# EAGLE design board (EAGLE 9.6.2)
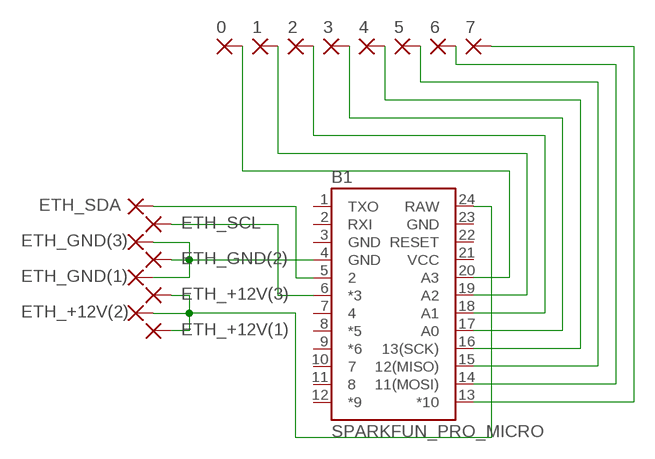
[diagram p0: schematic, sheet 1]

## Parts
0  2,15/1,0  [2,15/1,0]
1  2,15/1,0  [2,15/1,0]
2  2,15/1,0  [2,15/1,0]
3  2,15/1,0  [2,15/1,0]
4  2,15/1,0  [2,15/1,0]
5  2,15/1,0  [2,15/1,0]
6  2,15/1,0  [2,15/1,0]
7  2,15/1,0  [2,15/1,0]
B1  SPARKFUN_PRO_MICRO  [SPARKFUN_PRO_MICRO]
ETH_+12V(1)  2,15/1,0  [2,15/1,0]
ETH_+12V(2)  2,15/1,0  [2,15/1,0]
ETH_+12V(3)  2,15/1,0  [2,15/1,0]
ETH_GND(1)  2,15/1,0  [2,15/1,0]
ETH_GND(2)  2,15/1,0  [2,15/1,0]
ETH_GND(3)  2,15/1,0  [2,15/1,0]
ETH_SCL  2,15/1,0  [2,15/1,0]
ETH_SDA  2,15/1,0  [2,15/1,0]

## Nets
N$1: B1.5 ETH_SDA.1(P)
N$2: B1.6(*3) ETH_SCL.1(P)
N$3: B1.4(GND) ETH_GND(1).1(P) ETH_GND(2).1(P) ETH_GND(3).1(P)
N$4: B1.24(RAW) ETH_+12V(1).1(P) ETH_+12V(2).1(P) ETH_+12V(3).1(P)
N$5: 0.1(P) B1.20(A3)
N$6: 1.1(P) B1.19(A2)
N$7: 2.1(P) B1.18(A1)
N$8: 3.1(P) B1.17(A0)
N$9: 4.1(P) B1.16(13(SCK))
N$10: 5.1(P) B1.15(12(MISO))
N$11: 6.1(P) B1.14(11(MOSI))
N$12: 7.1(P) B1.13(*10)
Unconnected: B1.1(TXO) B1.2(RXI) B1.7 B1.8(*5) B1.9(*6) B1.10 B1.11 B1.12(*9) B1.22(RESET)

## Power pins joined to a net without a drawn wire
GND: B1.3(GND) B1.23(GND)
VCC: B1.21(VCC)

## Library data of the parts
0 1-7 ETH_+12V(1) ETH_+12V(2) ETH_+12V(3) ETH_GND(1) ETH_GND(2) ETH_GND(3) ETH_SCL ETH_SDA = wirepad:2,15/1,0: THROUGH-HOLE PAD
B1 = SparkFun-Boards:SPARKFUN_PRO_MICRO: SparkFun Pro Micro Atmega32U4 compatible footprint. SparkFun Products: 3.3V/8MHz <https://www.sparkfun.com/products/12587> 5V/16MHz <https://www.sparkfun.com/products/12640>

## Board
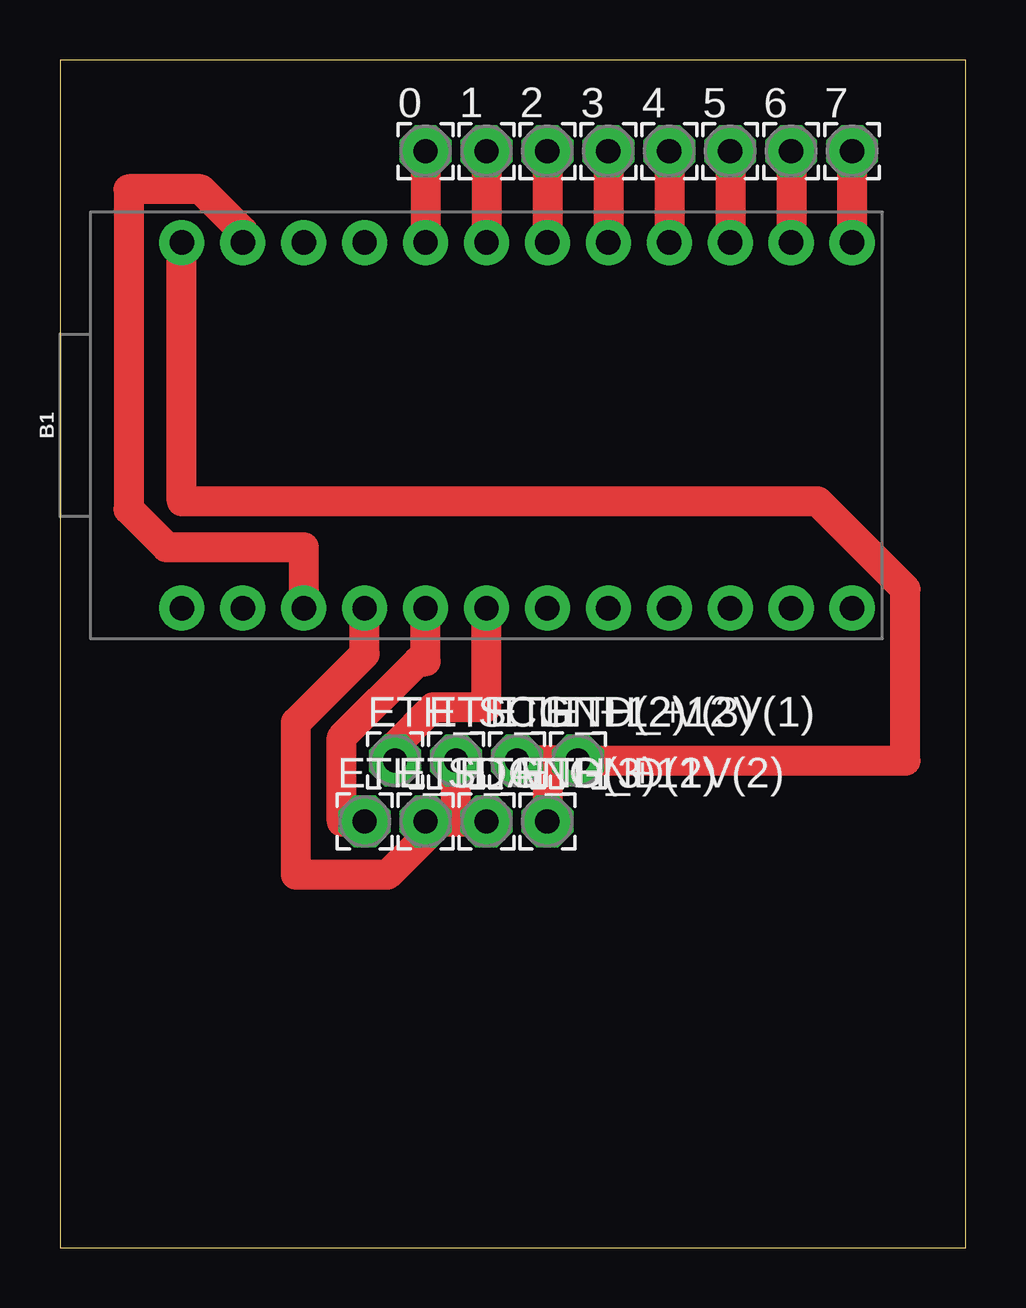
[diagram p1: board, top side]

Size 37.77 x 49.52 mm. Coordinates in mm from the lower left corner, seen from the top.
Outline: 0,0 37.77,0 37.77,49.52 0,49.52 0,0
Copper layers (1*16): Top 0.035mm / dielectric 1.5mm / Bottom 0.035mm
Design rules "default": minimum track width 6mil, minimum drill 0.35mm, track to track 6mil, track to pad 6mil, pad to pad 6mil, via to via 6mil, smd to smd 6mil, copper to edge 40mil, drill to drill 6mil, minimum pad ring 10mil, minimum via ring 8mil, stop-mask expansion 4mil, vias tented up to drill 0mil, thermal gap 10mil

### Footprints (pad centres in the part's own frame; a part is rotated, then mirrored left to right if it is on the bottom)
2,15/1,0 = drill 1.016 pad 2.159 octagon: 1 0,0
SPARKFUN_PRO_MICRO = drill 1.016 pad 1.88: 1 -7.62,12.7; 2 -7.62,10.16; 3 -7.62,7.62; 4 -7.62,5.08; 5 -7.62,2.54; 6 -7.62,0; 7 -7.62,-2.54; 8 -7.62,-5.08; 9 -7.62,-7.62; 10 -7.62,-10.16; 11 -7.62,-12.7; 12 -7.62,-15.24; 13 7.62,-15.24; 14 7.62,-12.7; 15 7.62,-10.16; 16 7.62,-7.62; 17 7.62,-5.08; 18 7.62,-2.54; 19 7.62,0; 20 7.62,2.54; 21 7.62,5.08; 22 7.62,7.62; 23 7.62,10.16; 24 7.62,12.7

### Placement (x,y rotation side)
0  15.24,45.72 0 top
1  17.78,45.72 0 top
2  20.32,45.72 0 top
3  22.86,45.72 0 top
4  25.4,45.72 0 top
5  27.94,45.72 0 top
6  30.48,45.72 0 top
7  33.02,45.72 0 top
B1  17.78,34.29 90 top
ETH_+12V(1)  21.59,20.32 0 top
ETH_+12V(2)  20.32,17.78 0 top
ETH_+12V(3)  19.05,20.32 0 top
ETH_GND(1)  17.78,17.78 0 top
ETH_GND(2)  16.51,20.32 0 top
ETH_GND(3)  15.24,17.78 0 top
ETH_SCL  13.97,20.32 0 top
ETH_SDA  12.7,17.78 0 top

### Tracks (layer width: path | path; a pad name or v marks a point on that pad's centre or on a via)
GND
  Top 1.25: B1.3 10.16,29.21 4.44,29.21 2.86,30.8 2.86,44.13 5.87,44.13 7.62,42.39 B1.23
N$1
  Top 1.25: B1.5 15.24,24.45 14.92,24.45 11.75,21.27 11.75,17.78 ETH_SDA.1
N$2
  Top 1.25: B1.6 17.78,22.54 15.56,22.54 13.97,20.95 ETH_SCL.1
N$3
  Top 1.25: B1.4 12.7,24.77 9.84,21.91 9.84,15.56 13.65,15.56 15.24,17.14 ETH_GND(3).1 16.51,17.78 | 16.51,17.78 ETH_GND(1).1 | 16.51,17.78 ETH_GND(2).1
N$4
  Top 1.25: B1.24 5.08,31.12 31.59,31.12 35.24,27.46 35.24,20.32 ETH_+12V(1).1 20.32,20.32 | 20.32,20.32 ETH_+12V(3).1 | 20.32,20.32 ETH_+12V(2).1
N$5
  Top 1.25: 0.1 B1.20
N$6
  Top 1.25: 1.1 B1.19
N$7
  Top 1.25: 2.1 B1.18
N$8
  Top 1.25: 3.1 B1.17
N$9
  Top 1.25: 4.1 B1.16
N$10
  Top 1.25: 5.1 B1.15
N$11
  Top 1.25: 6.1 B1.14
N$12
  Top 1.25: 7.1 B1.13